# Altium project gps_navigator.PrjPcb
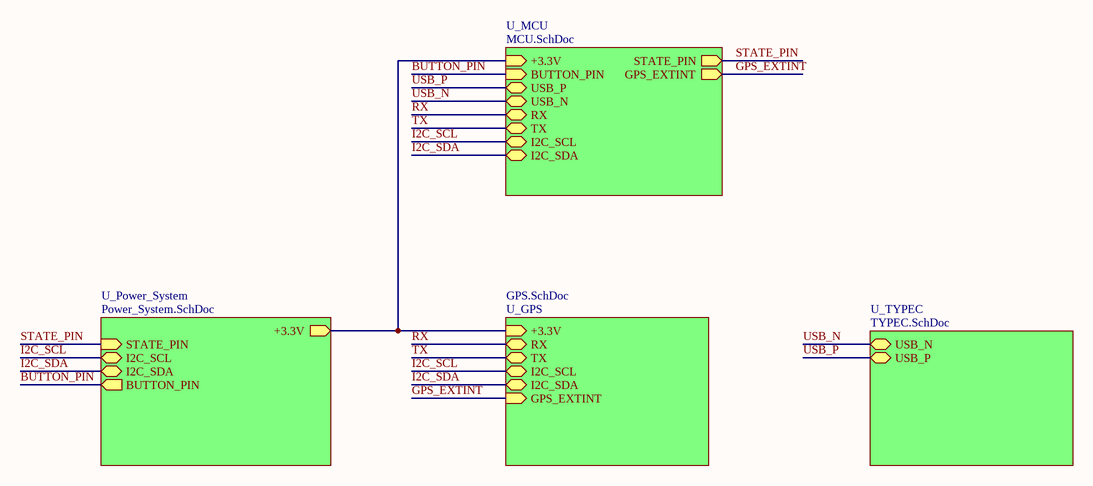
[diagram p0: Top.SchDoc]
ProjectAutor: Olexandr Makedonskyi; ProjectTitle: GPS Navigator; Project Version: v1.0
5 sheets, 74 parts. Net scope: hierarchical (ports join the sheet entries above them; power ports are global).
Board file: gps.PcbDoc
Sheets:
  Top.SchDoc
    U_Power_System = Power_System.SchDoc
    U_MCU = MCU.SchDoc
    U_TYPEC = TYPEC.SchDoc
    U_GPS = GPS.SchDoc

## Sheet Top.SchDoc
size A4; SheetNumber: 1; SheetTotal: 5

### Sub-sheets
U_GPS = GPS.SchDoc: RX (bidir), TX (bidir), I2C_SCL (bidir), I2C_SDA (bidir), +3.3V (in), GPS_EXTINT (in)
U_MCU = MCU.SchDoc: STATE_PIN (out), BUTTON_PIN (in), USB_P (bidir), USB_N (bidir), RX (bidir), TX (bidir), I2C_SCL (bidir), I2C_SDA (bidir), +3.3V (in), GPS_EXTINT (out)
U_Power_System = Power_System.SchDoc: STATE_PIN (in), BUTTON_PIN (out), +3.3V (out), I2C_SCL (bidir), I2C_SDA (bidir)
U_TYPEC = TYPEC.SchDoc: USB_N (bidir), USB_P (bidir)

### Nets
+3.3V: sheet U_Power_System/+3.3V, sheet U_MCU/+3.3V, sheet U_GPS/+3.3V
BUTTON_PIN: sheet U_Power_System/BUTTON_PIN, sheet U_MCU/BUTTON_PIN
GPS_EXTINT: sheet U_MCU/GPS_EXTINT, sheet U_GPS/GPS_EXTINT
I2C_SCL: sheet U_Power_System/I2C_SCL, sheet U_MCU/I2C_SCL, sheet U_GPS/I2C_SCL
I2C_SDA: sheet U_Power_System/I2C_SDA, sheet U_MCU/I2C_SDA, sheet U_GPS/I2C_SDA
RX: sheet U_MCU/RX, sheet U_GPS/RX
STATE_PIN: sheet U_Power_System/STATE_PIN, sheet U_MCU/STATE_PIN
TX: sheet U_MCU/TX, sheet U_GPS/TX
USB_N: sheet U_MCU/USB_N, sheet U_TYPEC/USB_N
USB_P: sheet U_MCU/USB_P, sheet U_TYPEC/USB_P

## Sheet Power_System.SchDoc
size A3; SheetNumber: 3; SheetTotal: 5
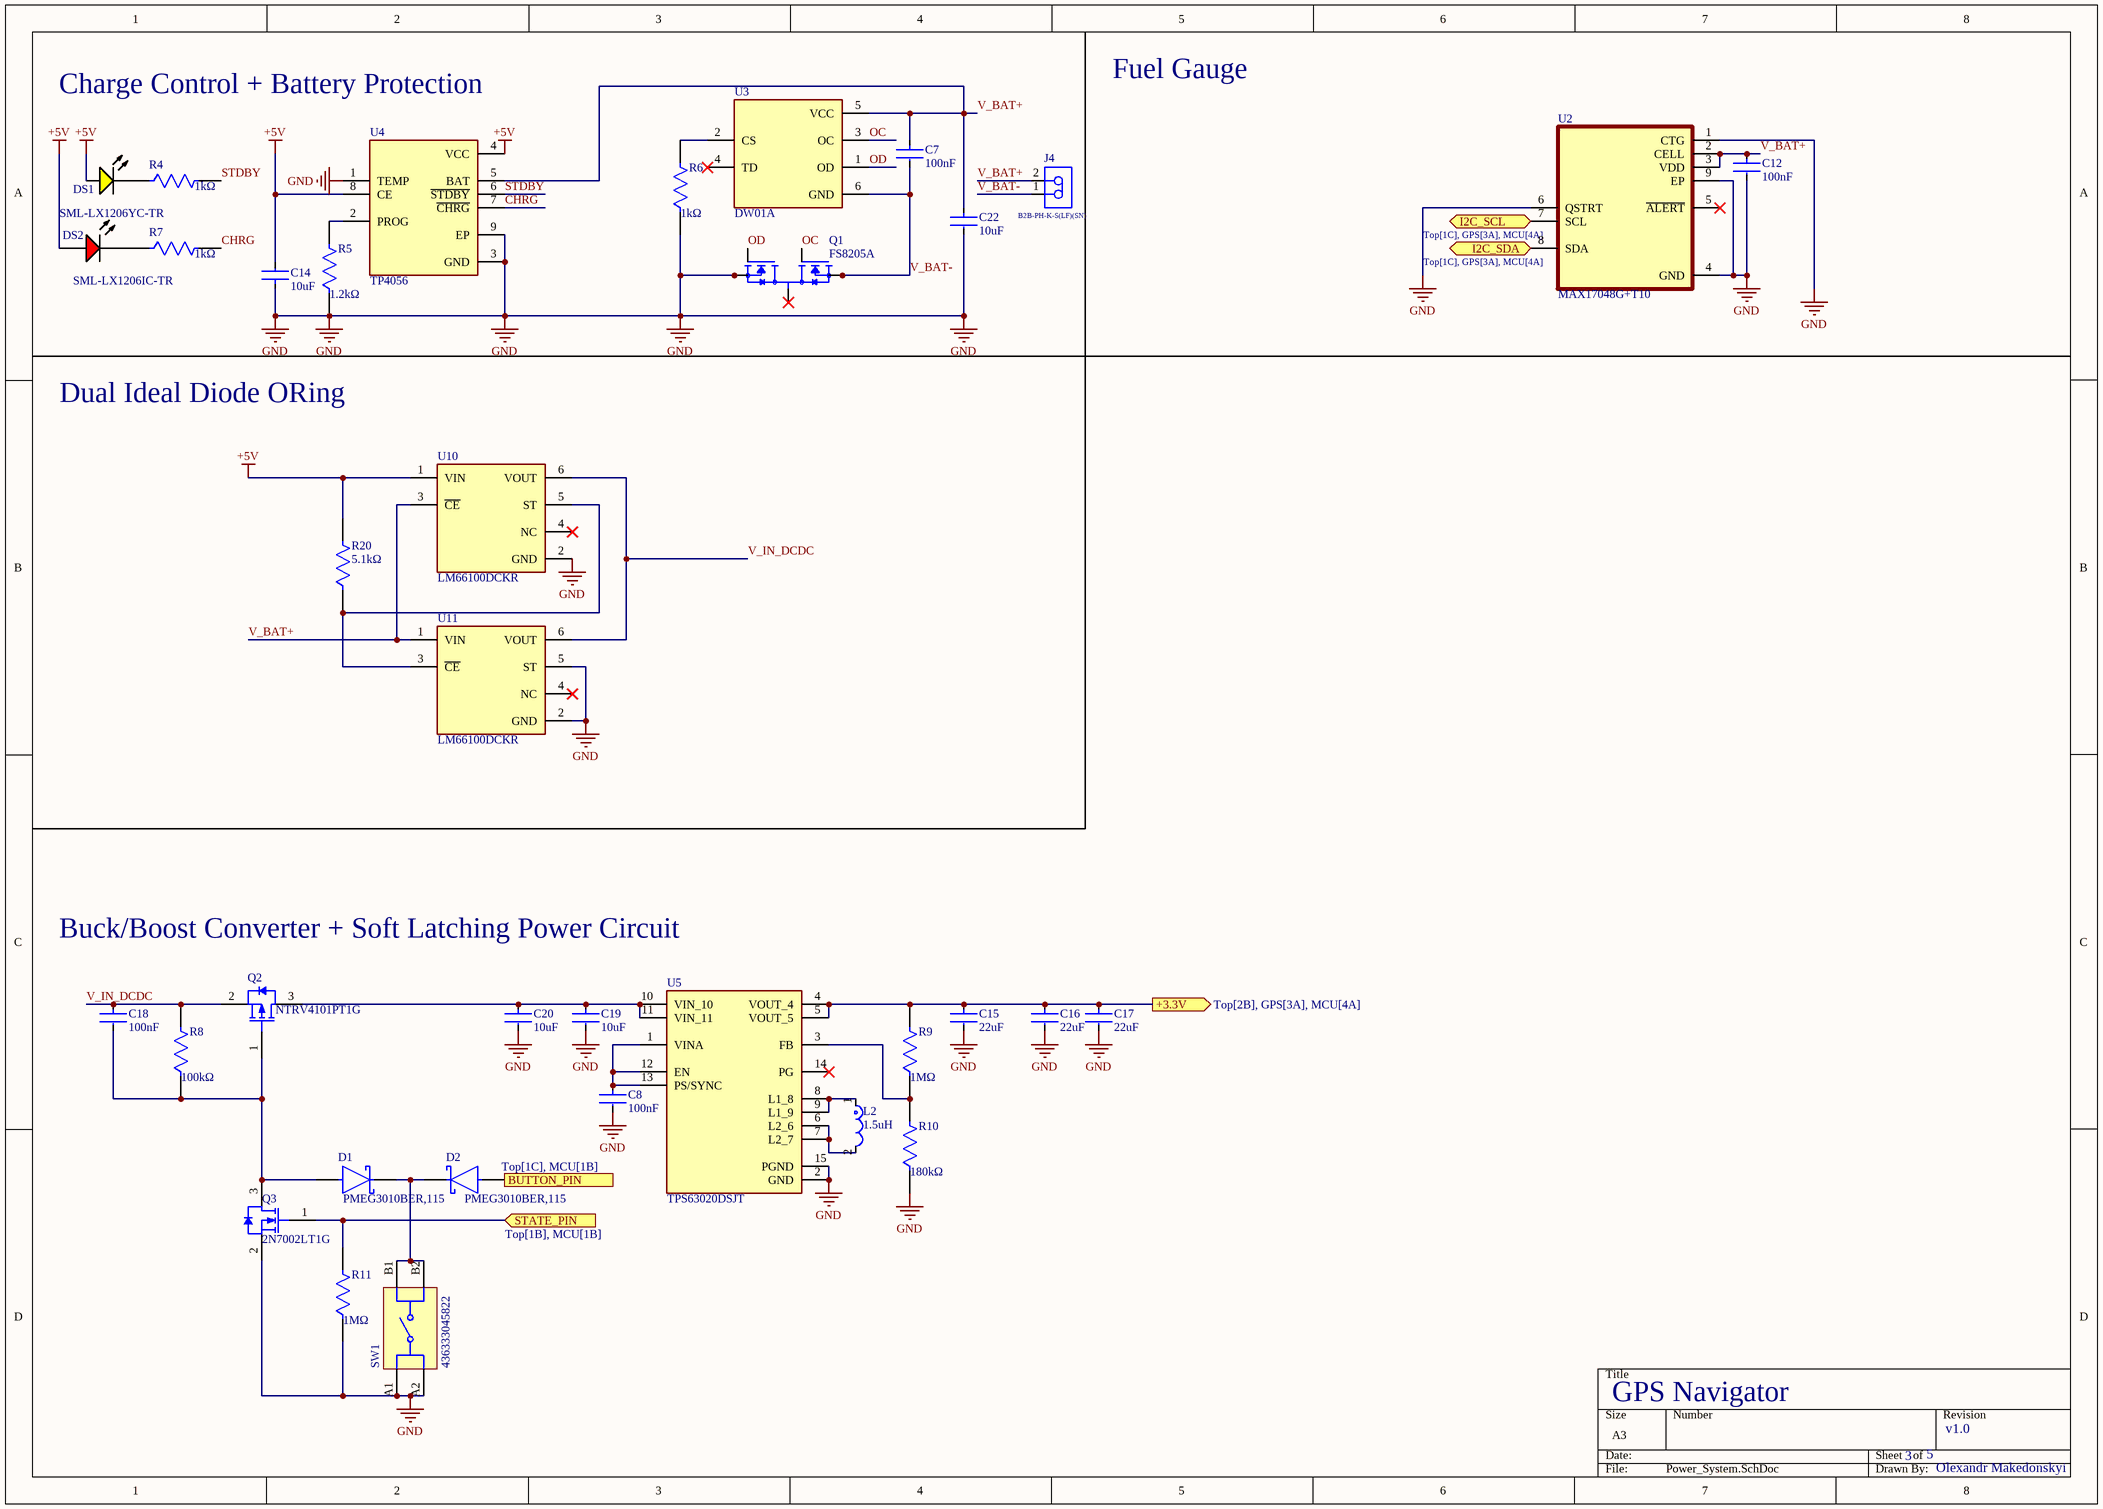
[diagram p1: Power_System.SchDoc]

### Parts
C7  100nF  [0402_CAPACITOR]
C8  100nF  [0402_CAPACITOR]
C12  100nF  [0603_CAPACITOR]
C14  10uF  [0402_CAPACITOR]
C15  22uF  [0603_CAPACITOR]
C16  22uF  [0603_CAPACITOR]
C17  22uF  [0603_CAPACITOR]
C18  100nF  [0603_CAPACITOR]
C19  10uF  [0603_CAPACITOR]
C20  10uF  [0603_CAPACITOR]
C22  10uF  [0402_CAPACITOR]
D1  PMEG3010BER,115  [SHOTTKY]
D2  PMEG3010BER,115  [SHOTTKY]
DS1  SML-LX1206YC-TR  [YELLOW_LED_1206]
DS2  SML-LX1206IC-TR  [RED_LED_1206]
J4  B2B-PH-K-S(LF)(SN)  [JST-B2B-PH-K-S_V]
L2  1.5uH  [1.5uH]
Q1  FS8205A  [SOP65P640X120-8N]
Q2  NTRV4101PT1G  [P_CHANNEL_MOSFET]
Q3  2N7002LT1G  [N_CHANNEL_MOSFET]
R4  value 1kΩ  [0402_RESISTOR]  (hidden comment: RESISTOR)
R5  value 1.2kΩ  [0402_RESISTOR]  (hidden comment: RESISTOR)
R6  value 1kΩ  [0402_RESISTOR]  (hidden comment: RESISTOR)
R7  value 1kΩ  [0402_RESISTOR]  (hidden comment: RESISTOR)
R8  value 100kΩ  [0603_RESISTOR]  (hidden comment: RESISTOR)
R9  value 1MΩ  [0603_RESISTOR]  (hidden comment: RESISTOR)
R10  value 180kΩ  [0603_RESISTOR]  (hidden comment: RESISTOR)
R11  value 1MΩ  [0603_RESISTOR]  (hidden comment: RESISTOR)
R20  value 5.1kΩ  [0603_RESISTOR]
SW1  436333045822  [SIDE_BUTTON]
U2  MAX17048G+T10  [MAX17048]
U3  DW01A  [SOT95P280X145-6N]
U4  TP4056  [SOP127P600X175-9N]
U5  TPS63020DSJT  [IC_TPS63020DSJT]
U10  LM66100DCKR  [ideal_diode]
U11  LM66100DCKR  [ideal_diode]

### Ports
+3.3V (out, see Top[2B], GPS[3A], MCU[4A]), BUTTON_PIN (out, see Top[1C], MCU[1B]), I2C_SCL (bidir, see Top[1C], GPS[3A], MCU[4A]), I2C_SDA (bidir, see Top[1C], GPS[3A], MCU[4A]), STATE_PIN (in, see Top[1B], MCU[1B])

### Nets
+5V: C14.2 DS1.1(A) DS2.1(A) R20.2 U4.4(VCC) U4.8(CE) U10.1(VIN)
GND: C8.2 C12.2 C14.1 C15.2 C16.2 C17.2 C19.2 C20.2 C22.2 Q1.2(S1) Q1.3(S1) Q3.2(S) R5.1 R6.1 R10.1 R11.1 SW1.A1 SW1.A2 U2.1(CTG) U2.4(GND) U2.6(QSTRT) U2.9(EP) U4.1(TEMP) U4.3(GND) U4.9(EP) U5.2(GND) U5.15(PGND) U10.2(GND) U11.2(GND) U11.5(ST)
+3.3V: C15.1 C16.1 C17.1 R9.2 U5.4(VOUT_4) U5.5(VOUT_5) ; port +3.3V
BUTTON_PIN: D2.2(A) ; port BUTTON_PIN
CHRG: R7.2 U4.7(~{CHRG})
I2C_SCL: U2.7(SCL) ; port I2C_SCL
I2C_SDA: U2.8(SDA) ; port I2C_SDA
OC: Q1.5(G2) U3.3(OC)
OD: Q1.4(G1) U3.1(OD)
STATE_PIN: Q3.1(G) R11.2 ; port STATE_PIN
STDBY: R4.2 U4.6(~{STDBY})
V_BAT+: C7.1 C12.1 C22.1 J4.2 U2.2(CELL) U2.3(VDD) U3.5(VCC) U4.5(BAT) U10.3(~{CE}) U11.1(VIN)
V_BAT-: C7.2 J4.1 Q1.6(S2) Q1.7(S2) U3.6(GND)
V_IN_DCDC: C18.1 Q2.2(S) R8.2 U10.6(VOUT) U11.6(VOUT)
NetC8_1: C8.1 U5.1(VINA) U5.12(EN) U5.13(PS/SYNC)
NetC18_2: C18.2 D1.2(A) Q2.1(G) Q3.3(D) R8.1
NetC19_1: C19.1 C20.1 Q2.3(D) U5.10(VIN_10) U5.11(VIN_11)
NetD1_1: D1.1(K) D2.1(K) SW1.B1 SW1.B2
NetDS1_2: DS1.2(K) R4.1
NetDS2_2: DS2.2(K) R7.1
NetL2_1: L2.1 U5.8(L1_8) U5.9(L1_9)
NetL2_2: L2.2 U5.6(L2_6) U5.7(L2_7)
NetQ1_1: Q1.1(D12) Q1.8(D12)
NetR5_2: R5.2 U4.2(PROG)
NetR6_2: R6.2 U3.2(CS)
NetR9_1: R9.1 R10.2 U5.3(FB)
NetR20_1: R20.1 U10.5(ST) U11.3(~{CE})

Not connected (* = marked no-connect by the designer): U2 5(~{ALERT})*; U3 4(TD)*; U5 14(PG)*; U10 4(NC)*; U11 4(NC)*

### Notes on the sheet
- Charge Control + Battery Protection
- Fuel Gauge
- Dual Ideal Diode ORing
- Buck/Boost Converter + Soft Latching Power Circuit

### Library data of the parts
C7 C8 C12 C14-C20 C22 = CMP-001-00091-1: Design Item ID: CAPACITOR; Source: gps_project_schematic_library.SchLib
D1 D2 = SHOTTKY: DIODE SCHOTTKY 30V 1A SOD123W; Manufacturer: Nexperia; Automotive Grade: Grade 0; Max Surge Forward Current: 50A; Peak Reverse Current: 15uA; Max Junction Temp: +150°C; Capacitance: 170pF; Value: 170pF; ComponentLink2URL: https://assets.nexperia.com/documents/data-sheet/PMEG3010BER.pdf; Reverse Voltage: 30V; Forward Current: 1A; Ambient Temperature Range Low: -55°C; Ambient Temperature Range High: +150°C; Octopart: https://octopart.com/pmeg3010ber%2C115-nexperia-78741454; Package: SOD123W; Category: Diode; Lead Free: Yes; Digikey Description: DIODE SCHOTTKY 30V 1A SOD123W; Automotive: Yes; RoHS: TRUE; Height: 1.1mm; Temperature: to +150°C; Device Class L2: Diodes; ComponentLink2Description: Datasheet; Manufacturer Part Number: PMEG3010BER,115; Temperature Range High: +150°C; Device Class L3: Schottky Diodes; Device Class L1: Discrete Semiconductors; Footprint Url: https://assets.nexperia.com/documents/outline-drawing/SOD123W.pdf
DS1 = YELLOW_LED_1206: Yellow LED, Water Clear Len, 585 nm, 2.1 V, -40 to 85 degC, 2-Pin SMD, RoHS, Tape and Reel; Manufacturer: Lumex; Product Training Modules: LEDsBenefitsofCustomLEDandLCDTechnology; Millicandela Rating: 6mcd; Catalog Drawings: SML-LX1206SeriesTopSML-LX1206SeriesSideSML-LX1206SeriesBottomSML-LX1206SeriesFootprint; Wavelength - Peak: 585nm; Other Names: 67-1358-2LU60357TRSMLLX1206YCTR; Lens Style/Size: RectanglewithFlatTop; Current - Test: 20mA; Lens Color: Colorless; Viewing Angle: 160°; Voltage - Forward (Vf) (Typ): 2.1V; Online Catalog: SML-LX1206RectanglewithFlatTop1206PackageLEDs; Mounting Type: SurfaceMount; Package Description: 2-Pin Surface Mount Device, Body 3.2 x 1.5 mm; Datasheet Version: Rev. K, 08/2012; Features: -; Color: Yellow; RoHS Information: RoHSCertofCompliance; Package Reference: SML-LX1206YC-TR; Supplier Device Package: 1206; Standard Package: 3,000; Series: -; Wavelength - Dominant: -; Package / Case: 1206(3216Metric); Mounting Technology: SurfaceMount; Height (Max): 1.10mm; Lens Transparency: Clear; Datasheet URL: http://www.lumex.com/content/files/ProductAttachment/SML-LX1206YC-TR.pdf; Family: LEDIndication-Discrete; Manufacturer URL: http://www.lumexinstruments.com/; Packaging: Tape&Reel(TR); Category: Optoelectronics; Size / Dimension: 3.20mmLx1.60mmW
DS2 = LED_RED_1206: LED Red, 65 mW, -40 to 85 degC, 2-Pin SMD, RoHS, Tape and Reel; Manufacturer: Lumex; LED Material: GaAsP; Peak Wavelength: 635nm; Number of LEDs: 1; Viewing Angle: 160; Reverse Voltage: 5(Min)V; Lens Appearance: ColorlessNonDiffused; Intensity: 6mcd; Type: Uni-Color; Pin_Count: 2; Lens Dimensions: 2x1.6x0.5mm; Mounting: SurfaceMount; ECCN: EAR99; RoHS: Unknown; Package Description: 2-Pin Surface Mount Device, Body 3.2 x 1.5 mm; Mounting Technology: SurfaceMount; Dominant Wavelength: N/A; Supplier_Package: SMD; Supplier Standard Pack: 3,000; Color: Red; Dimension: 3.2x1.6x1.1mm; HTS: 8541402000; Part No: SML-LX1206IC-TR; Family: SML-LX1206IC; Supplier: Lumex; Datasheet URL: http://www.lumex.com/content/files/ProductAttachment/SML-LX1206IC-TR.pdf; Package Reference: SML-LX1206IC; Manufacturer URL: http://www.lumexinstruments.com/; Operating Temperature: -25to85C; Packaging: TapeandReel; Datasheet Version: Rev. J, 08/2012
J4 = JST CONNECTOR: Male Header, Pitch 2 mm, 1 x 2 Position, Height 6 mm, Tail Length 3.4 mm, -25 to 85 degC, RoHS, Bulk; Manufacturer: JST; Pitch: 2mm; Style/Orientation: StraightHeader/Plug; No of Positions: 2; Datasheet Version: Nov-08; Datasheet URL: http://datasheet.octopart.com/B2B-PH-K-S%28LF%29%28SN%29-JST-datasheet-8324864.pdf; Manufacturer URL: http://www.jst.com/home2.html; Type: ShroudedHeader; Termination: Crimp
L2 = 1.5uH: Inductor Power Shielded Wirewound 1.5uH 20% 100KHz 9.1A 15.8mOhm DCR 1515 Automotive Embossed Plastic T/R; Core Material: Composite; DC Resistance (DCR): 15.8mR; Saturation Current: 4.1A; Self Resonant Frequency: 59MHz; Tolerance: 20%; Inductance: 1.5uH; Max DC Current: 9.1A; RoHS Compliant: Yes; Max Operating Temperature: 125°C; Length: 4.3mm; Case/Package: SMD/SMT; Mount: Surface Mount; Shielding: Shielded; Min Operating Temperature: -40°C; RMS Current (Irms): 9.1A; Test Frequency: 100kHz; Inductance Tolerance: 20%; REACH SVHC: No SVHC; Packaging: Tape and Reel; Termination: SMD/SMT; Lead Free: Contains Lead; Width: 4.3mm; Series: XFL4020; Height: 2.1mm
Q1 = FS8205A: MF: Fortune Semiconductor; SnapEDA_Link: https://www.snapeda.com/parts/FS8205A/Fortune+Semiconductor/view-part/?ref=snap; Package: Package; Value: *; MP: FS8205A; Check_prices: https://www.snapeda.com/parts/FS8205A/Fortune+Semiconductor/view-part/?ref=eda
Q2 = PMOS: Trench Power MOSFET, -20 V, Single P-Channel, 3-Pin SOT-23, Pb-Free, Tape and Reel; Manufacturer: On Semiconductor; Crss Typ (pF): 75; V(BR)DSS Min (V): 20; Coss Typ (pF): 100; Ciss Typ (pF): 675; VGS Max (V): 8; Channel Polarity: P Channel; ID Max (A): 3.2; VGS(th) Max (V): 1.2; Qrr Typ (nC): 1008; ComponentLink2URL: http://www.onsemi.cn/pub_link/Collateral/NTR4101P-D.PDF; PartNumber: NTRV4101PT1G; ComponentLink1Description: Manufacturer URL; Packing: Tape and Reel; ComponentLink1URL: http://www.onsemi.com/; PackageReference: SOT-23-3-318-08; ComponentLink3URL: http://www.onsemi.cn/pub_link/Collateral/318-08.PDF; PackageVersion: Rev. AP, 11/2009; Package Type: SOT-23-3; Configuration: Single; ComponentLink3Description: Package Specification; Mounting Technology: Surface Mount; RoHS: Pb-Free; ComponentLink2Description: Datasheet; PackageDescription: 3-Pin Small Outline Transistor, Body 2.92 x 1.3 mm, Pitch 0.95 mm; DatasheetVersion: Rev. 9
Q3 = NMOS: Small Signal MOSFET, 60 V, 115 mA, N-Channel, 3-Pin SOT-23, Pb-Free, Tape and Reel; Manufacturer: On Semiconductor; Channel Polarity: N Channel; V(BR)DSS Min (V): 60; ID Max (A): 0.115; VGS Max (V): 20; Configuration: Single; VGS(th) Max (V): 2.5; ComponentLink1URL: http://www.onsemi.com/; ComponentLink3Description: Package Specification; ComponentLink3URL: http://www.onsemi.cn/pub_link/Collateral/318-08.PDF; PackageReference: SOT-23-3-318-08; RoHS: Pb-Free; ComponentLink2URL: http://www.onsemi.com/pub_link/Collateral/2N7002L-D.PDF; ComponentLink1Description: Manufacturer URL; Package Type: SOT-23-3; Packing: Tape and Reel; PartNumber: 2N7002LT1G; DatasheetVersion: Rev. 7; Mounting Technology: Surface Mount; ComponentLink2Description: Datasheet; PackageDescription: 3-Pin Small Outline Transistor, Body 2.92 x 1.3 mm, Pitch 0.95 mm; PackageVersion: Rev. AP, 11/2009
R20 = RESISTOR
SW1 = SIDE_BUTTON: Tactile Switch, WS-TASU Series, Side Actuated, SMD, Rectangular Button; Voltage Rating: 12V; Operating Force: 220N; Contact Resistance: 100mΩ; Current Rating: 50mA; Packaging: Tape and Reel; Contact Plating: Silver; Width: 4.7mm; Min Operating Temperature: -40°C; Insulation Resistance: 100MΩ; Height: 1.65mm; Contact Current Rating: 50mA; Max Operating Temperature: 85°C; RoHS: Compliant
U2 = MAX17048G+T10: 3ÂµA 1-Cell/2-Cell Fuel Gauge with ModelGauge; MF: Analog Devices; Package: TDFN-8 Maxim; Price: None; Check_prices: https://www.snapeda.com/parts/MAX17048G+T10/Analog+Devices/view-part/?ref=eda; Value: *; SnapEDA_Link: https://www.snapeda.com/parts/MAX17048G+T10/Analog+Devices/view-part/?ref=snap; MP: MAX17048G+T10; Availability: In Stock; Purchase-URL: https://pricing.snapeda.com/search/part/MAX17048G+T10/?ref=eda
U3 = DW01A: One Cell Lithium-ion/Polymer Battery Protection IC; MF: Fortune Semiconductor; SnapEDA_Link: https://www.snapeda.com/parts/DW01A/Fortune+Semiconductor/view-part/?ref=snap; Package: SOT-23-6 Fortune Semiconductor; Value: *; MP: DW01A; Check_prices: https://www.snapeda.com/parts/DW01A/Fortune+Semiconductor/view-part/?ref=eda
U4 = TP4056: Complete single cell Li-Ion battery with a constant current / constant voltage linear charger; MF: NanJing Top Power ASIC Corp.; Check_prices: https://www.snapeda.com/parts/TP4056/NanJing+Top+Power+ASIC+Corp./view-part/?ref=eda; SnapEDA_Link: https://www.snapeda.com/parts/TP4056/NanJing+Top+Power+ASIC+Corp./view-part/?ref=snap; Price: None; Availability: Not in stock; Package: Package; MP: TP4056; Value: *
U5 = TPS63020DSJT: High Efficiency Single Inductor Buck-Boost Converter with 4A Switch; MF: Texas Instruments; SnapEDA_Link: https://www.snapeda.com/parts/TPS63020DSJT/Texas+Instruments/view-part/?ref=snap; Package: VSON-14 Texas Instruments; Value: *; MP: TPS63020DSJT; Check_prices: https://www.snapeda.com/parts/TPS63020DSJT/Texas+Instruments/view-part/?ref=eda
U10 U11 = LM66100DCKR: 1.5-V to 5.5-V, 1.5-A, 0.5-ÂµA IQ ideal diode with integrated FET; MF: Texas Instruments; SnapEDA_Link: https://www.snapeda.com/parts/LM66100DCKR/Texas+Instruments/view-part/?ref=snap; Package: SOT-SC70-6 Texas Instruments; Value: *; MP: LM66100DCKR; Check_prices: https://www.snapeda.com/parts/LM66100DCKR/Texas+Instruments/view-part/?ref=eda

## Sheet MCU.SchDoc
size A4; SheetNumber: 2; SheetTotal: 5
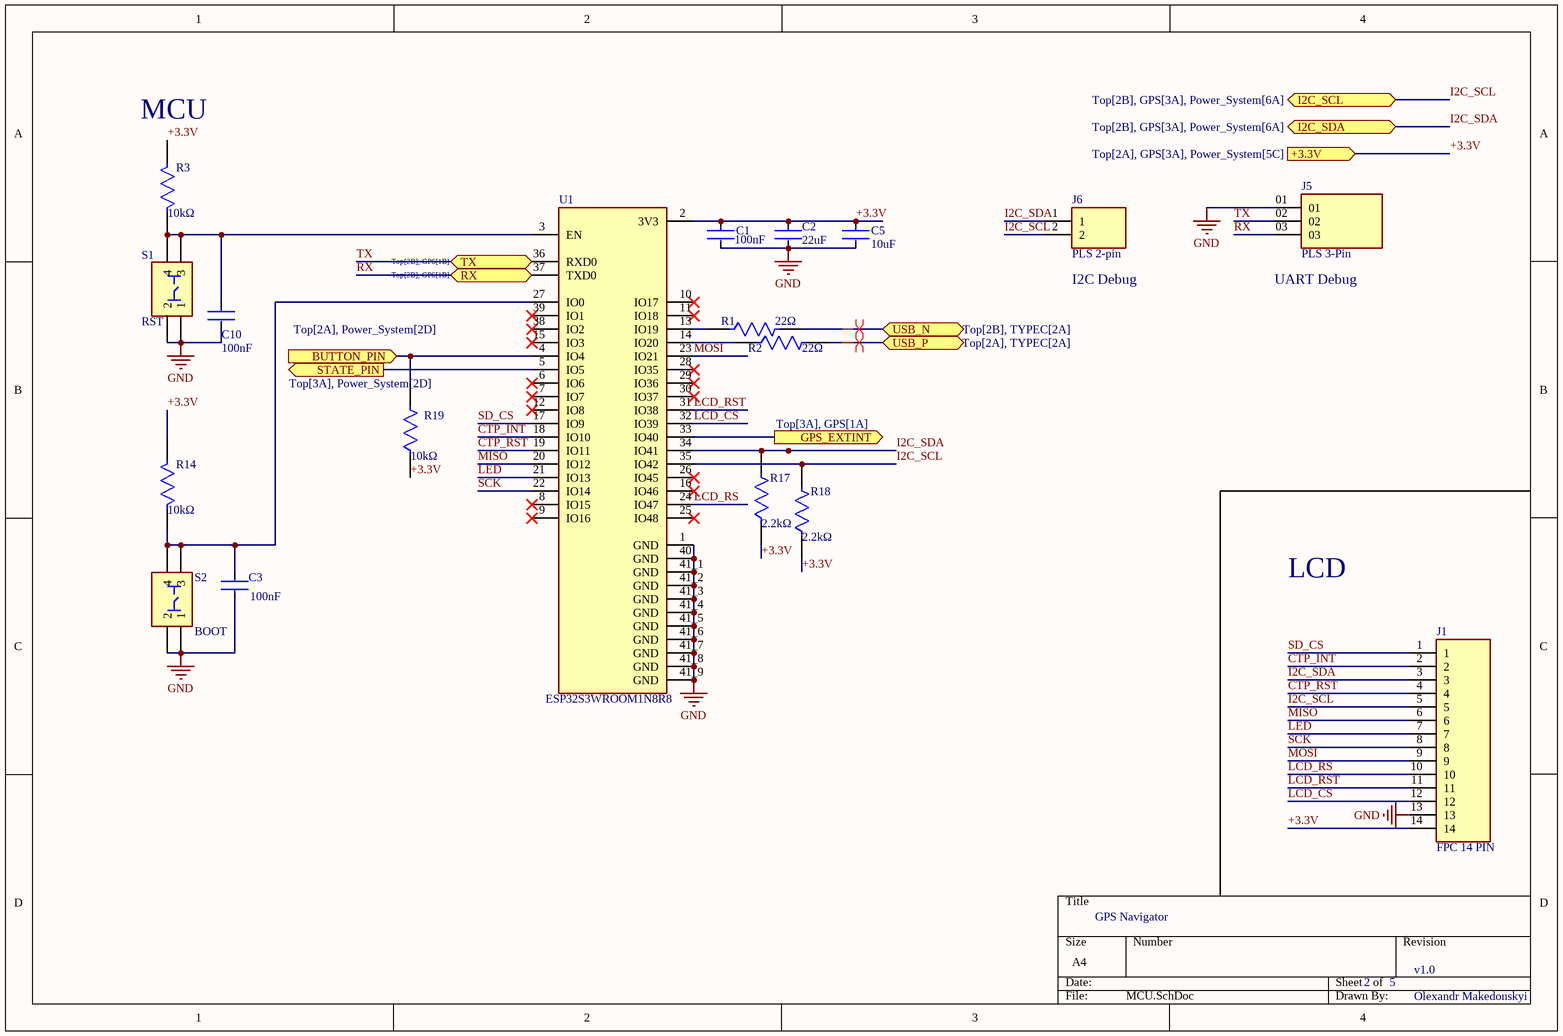
[diagram p2: MCU.SchDoc]

### Parts
C1  100nF  [0603_CAPACITOR]
C2  22uF  [0603_CAPACITOR]
C3  100nF  [0603_CAPACITOR]
C5  10uF  [0603_CAPACITOR]
C10  100nF  [0603_CAPACITOR]
J1  FPC 14 PIN  [AMPHENOL_10051922-1410ELF]
J5  PLS 3-Pin  [SAMTEC_MTLW-103-05-G-S-135]
J6  PLS 2-pin  [2-pin_pls]
R1  value 22Ω  [0402_RESISTOR]  (hidden comment: RESISTOR)
R2  value 22Ω  [0402_RESISTOR]  (hidden comment: RESISTOR)
R3  value 10kΩ  [0603_RESISTOR]  (hidden comment: RESISTOR)
R14  value 10kΩ  [0603_RESISTOR]  (hidden comment: RESISTOR)
R17  value 2.2kΩ  [0603_RESISTOR]  (hidden comment: RESISTOR)
R18  value 2.2kΩ  [0603_RESISTOR]  (hidden comment: RESISTOR)
R19  value 10kΩ  [0402_RESISTOR]  (hidden comment: RESISTOR)
S1  RST  [SMD_BUTTON]
S2  BOOT  [SMD_BUTTON]
U1  ESP32S3WROOM1N8R8  [XCVR_ESP32S3WROOM1N8R8]

### Ports
+3.3V (in, see Top[2A], GPS[3A], Power_System[5C]), BUTTON_PIN (in, see Top[2A], Power_System[2D]), GPS_EXTINT (out, see Top[3A], GPS[1A]), I2C_SCL (bidir, see Top[2B], GPS[3A], Power_System[6A]), I2C_SDA (bidir, see Top[2B], GPS[3A], Power_System[6A]), RX (bidir, see Top[2B], GPS[1B]), STATE_PIN (out, see Top[3A], Power_System[2D]), TX (bidir, see Top[2B], GPS[1B]), USB_N (bidir, see Top[2B], TYPEC[2A]), USB_P (bidir, see Top[2A], TYPEC[2A])

### Nets
GND: C1.2 C2.2 C3.1 C5.2 C10.2 J1.13 J5.01 S1.1 S1.2 S2.1 S2.2 U1.1(GND) U1.40(GND) U1.41_1(GND) U1.41_2(GND) U1.41_3(GND) U1.41_4(GND) U1.41_5(GND) U1.41_6(GND) U1.41_7(GND) U1.41_8(GND) U1.41_9(GND)
+3.3V: C1.1 C2.1 C5.1 J1.14 R3.2 R14.2 R17.1 R18.1 R19.1 U1.2(3V3) ; port +3.3V
BUTTON_PIN: R19.2 U1.4(IO4) ; port BUTTON_PIN
CTP_INT: J1.2 U1.18(IO10)
CTP_RST: J1.4 U1.19(IO11)
GPS_EXTINT: U1.33(IO40) ; port GPS_EXTINT
I2C_SCL: J1.5 J6.2 R18.2 U1.35(IO42) ; port I2C_SCL
I2C_SDA: J1.3 J6.1 R17.2 U1.34(IO41) ; port I2C_SDA
LCD_CS: J1.12 U1.32(IO39)
LCD_RS: J1.10 U1.24(IO47)
LCD_RST: J1.11 U1.31(IO38)
LED: J1.7 U1.21(IO13)
MISO: J1.6 U1.20(IO12)
MOSI: J1.9 U1.23(IO21)
RX: J5.03 U1.37(TXD0) ; port RX
SCK: J1.8 U1.22(IO14)
SD_CS: J1.1 U1.17(IO9)
STATE_PIN: U1.5(IO5) ; port STATE_PIN
TX: J5.02 U1.36(RXD0) ; port TX
USB_N: R1.2 ; port USB_N
USB_P: R2.2 ; port USB_P
NetC3_2: C3.2 R14.1 S2.3 S2.4 U1.27(IO0)
NetC10_1: C10.1 R3.1 S1.3 S1.4 U1.3(EN)
NetR1_1: R1.1 U1.13(IO19)
NetR2_1: R2.1 U1.14(IO20)

Not connected (* = marked no-connect by the designer): U1 6(IO6)* 7(IO7)* 8(IO15)* 9(IO16)* 10(IO17)* 11(IO18)* 12(IO8)* 15(IO3)* 16(IO46)* 25(IO48)* 26(IO45)* 28(IO35)* 29(IO36)* 30(IO37)* 38(IO2)* 39(IO1)*

### Layout directives
differential pair: USB_N, USB_P

### Notes on the sheet
- (near R3) MCU
- (near J6) I2C Debug
- (near J5) UART Debug
- LCD

### Library data of the parts
C1-C3 C5 C10 = CMP-001-00091-1: Design Item ID: CAPACITOR; Source: gps_project_schematic_library.SchLib
J1 = FPC 14 PIN: Conn;Rect; FPC/FFC; 14 Pos; Rt. Ang; 0.5 mm; SMT;ZIF; Low Side Cont; VLL Ser; LF | Amphenol FCI (Amphenol CS) 10051922-1410ELF; SnapEDA_Link: https://www.snapeda.com/parts/10051922-1410ELF/Amphenol/view-part/?ref=snap; Package: None; Value: *; MF: Amphenol; MP: 10051922-1410ELF; Check_prices: https://www.snapeda.com/parts/10051922-1410ELF/Amphenol/view-part/?ref=eda
J5 = MTLW-103-05-G-S-135: CONN HEADER VERT 3POS 2.54MM; MF: Samtec; SnapEDA_Link: https://www.snapeda.com/parts/MTLW-103-05-G-S-135/Samtec/view-part/?ref=snap; Package: None; Value: *; MP: MTLW-103-05-G-S-135; Check_prices: https://www.snapeda.com/parts/MTLW-103-05-G-S-135/Samtec/view-part/?ref=eda
J6 = PLS 2-pin: Conn Unshrouded Header HDR 2 POS 2.54mm Solder ST Thru-Hole; Centerline_Pitch: 2.54 mm[.1 in]; Product_Type: Connector; MF: TE Connectivity; Number_of_Positions: 2; MP: 826646-2; Availability: Good; Price: None; EU_RoHS_Compliance: Compliant; Value: *; DigiKey-Purchase-URL: https://snapeda.com/shop?store=DigiKey&id=470405; Mouser-Purchase-URL: https://snapeda.com/shop?store=Mouser&id=470405; SnapEDA_Link: https://www.snapeda.com/parts/826646-2/TE%20Connectivity%20AMP%20Connectors/view-part/470405/?ref=snap; Package: None
S1 S2 = SMD_BUTTON: Tactile Switch SPST-NO Top Actuated Surface Mount; MF: C&K; MP: PTS810 SJK 250 SMTR LFS; SnapEDA_Link: https://www.snapeda.com/parts/PTS810%20SJK%20250%20SMTR%20LFS/C%2526K/view-part/?ref=snap; Package: None; Value: *; Check_prices: https://www.snapeda.com/parts/PTS810%20SJK%20250%20SMTR%20LFS/C%2526K/view-part/?ref=eda
U1 = ESP32S3WROOM1N8R8: Bluetooth, WiFi 802.11b/g/n, Bluetooth v5.0 Transceiver Module 2.4GHz PCB Trace Surface Mount; MF: Espressif Systems; Price: None; MP: ESP32S3WROOM1N8R8; SnapEDA_Link: https://www.snapeda.com/parts/ESP32S3WROOM1N8R8/Espressif+Systems/view-part/?ref=snap; Package: SMD-41 Espressif Systems; Availability: In Stock; Purchase-URL: https://pricing.snapeda.com/search/part/ESP32S3WROOM1N8R8/?ref=eda; Check_prices: https://www.snapeda.com/parts/ESP32S3WROOM1N8R8/Espressif+Systems/view-part/?ref=eda; Value: *

## Sheet TYPEC.SchDoc
size A4; SheetNumber: 5; SheetTotal: 5
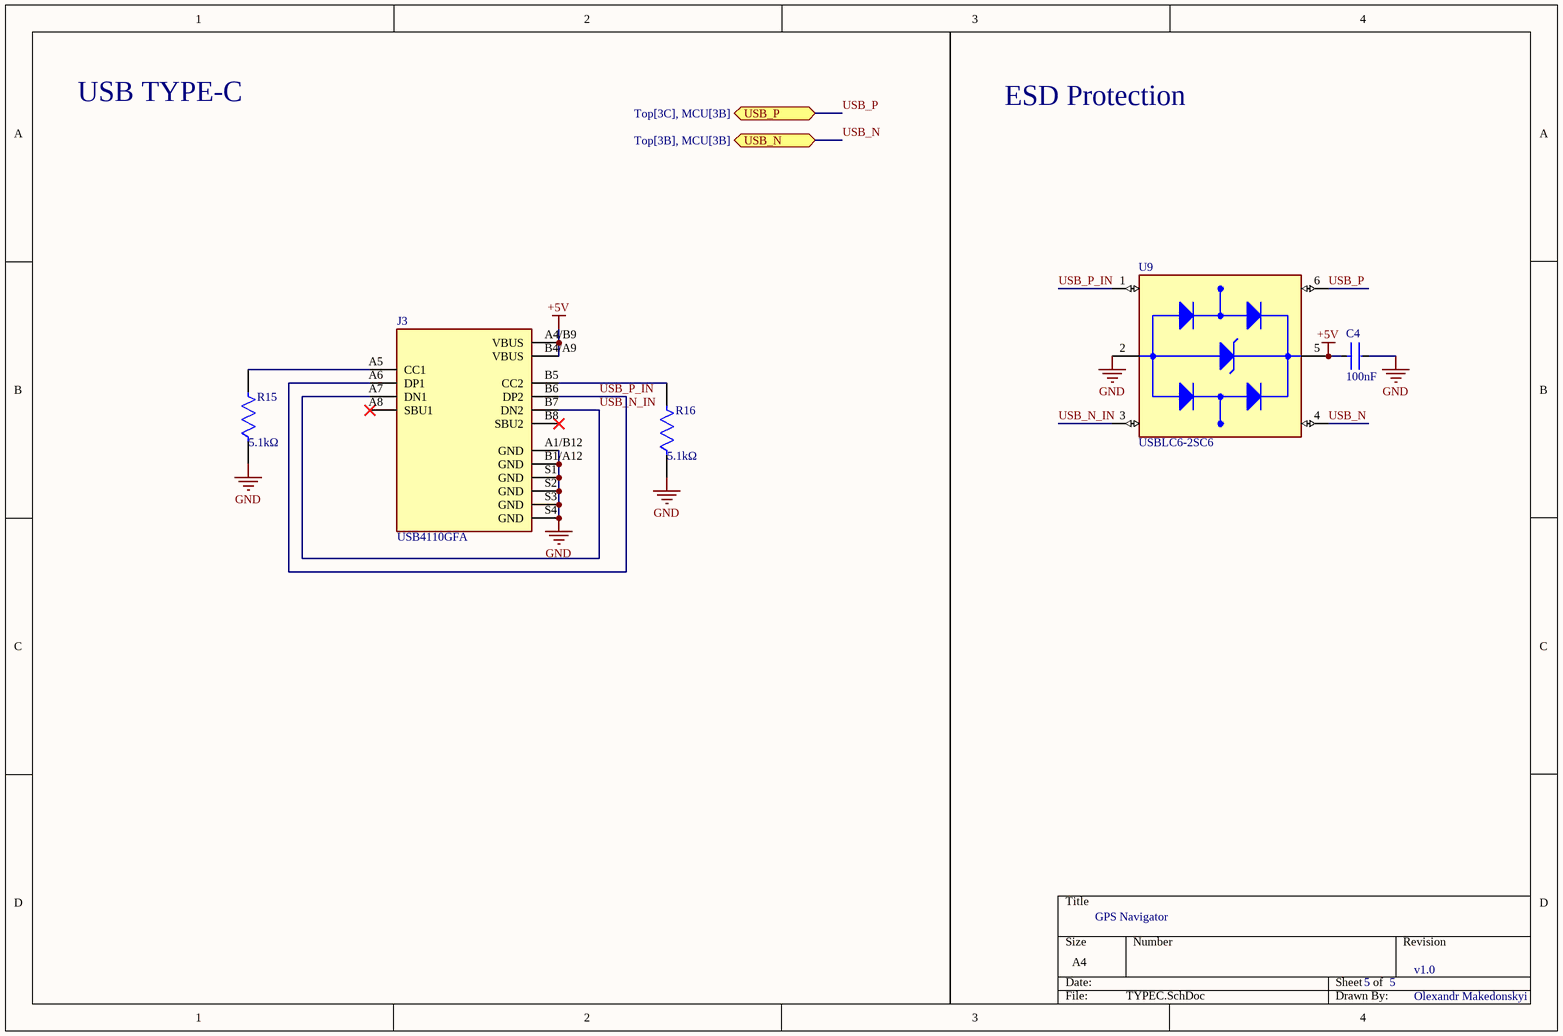
[diagram p3: TYPEC.SchDoc]

### Parts
C4  100nF  [0402_CAPACITOR]
J3  USB4110GFA  [GCT_USB4110GFA]
R15  value 5.1kΩ  [0402_RESISTOR]  (hidden comment: RESISTOR)
R16  value 5.1kΩ  [0603_RESISTOR]  (hidden comment: RESISTOR)
U9  USBLC6-2SC6  [SOT95P280X145-6N]

### Ports
USB_N (bidir, see Top[3B], MCU[3B]), USB_P (bidir, see Top[3C], MCU[3B])

### Nets
+5V: C4.1 J3.A4/B9(VBUS) J3.B4/A9(VBUS) U9.5(VBUS)
GND: C4.2 J3.A1/B12(GND) J3.B1/A12(GND) J3.S1(GND) J3.S2(GND) J3.S3(GND) J3.S4(GND) R15.1 R16.1 U9.2(GND)
USB_N: U9.4(I/O2_OUT) ; port USB_N
USB_N_IN: J3.A7(DN1) J3.B7(DN2) U9.3(I/O2_IN)
USB_P: U9.6(I/O1_OUT) ; port USB_P
USB_P_IN: J3.A6(DP1) J3.B6(DP2) U9.1(I/O1_IN)
NetJ3_A5: J3.A5(CC1) R15.2
NetJ3_B5: J3.B5(CC2) R16.2

Not connected (* = marked no-connect by the designer): J3 A8(SBU1)* B8(SBU2)*

### Notes on the sheet
- USB TYPE-C
- ESD Protection

### Library data of the parts
C4 = CMP-001-00091-1: Design Item ID: CAPACITOR; Source: gps_project_schematic_library.SchLib
J3 = USB4110GFA: USB-C (USB TYPE-C) USB 2.0 Receptacle Connector 24 (16+8 Dummy) Position Surface Mount, Right Angle; MF: Global Connector Technology; SnapEDA_Link: https://www.snapeda.com/parts/USB4110GFA/Global+Connector+Technology/view-part/?ref=snap; Package: None; Value: *; MP: USB4110GFA; Check_prices: https://www.snapeda.com/parts/USB4110GFA/Global+Connector+Technology/view-part/?ref=eda
U9 = USBLC6-2SC6: 17V Clamp 5A (8/20Âµs) Ipp Tvs Diode Surface Mount SOT-23-6; MF: STMicroelectronics; Value: *; SnapEDA_Link: https://www.snapeda.com/parts/USBLC6-2SC6/STMicroelectronics/view-part/?ref=snap; Check_prices: https://www.snapeda.com/parts/USBLC6-2SC6/STMicroelectronics/view-part/?ref=eda; Purchase-URL: https://pricing.snapeda.com/search/part/USBLC6-2SC6/?ref=eda; Price: None; Availability: In Stock; Package: SOT-23-6 STMicroelectronics; MP: USBLC6-2SC6

## Sheet GPS.SchDoc
size A4; SheetNumber: 4; SheetTotal: 5
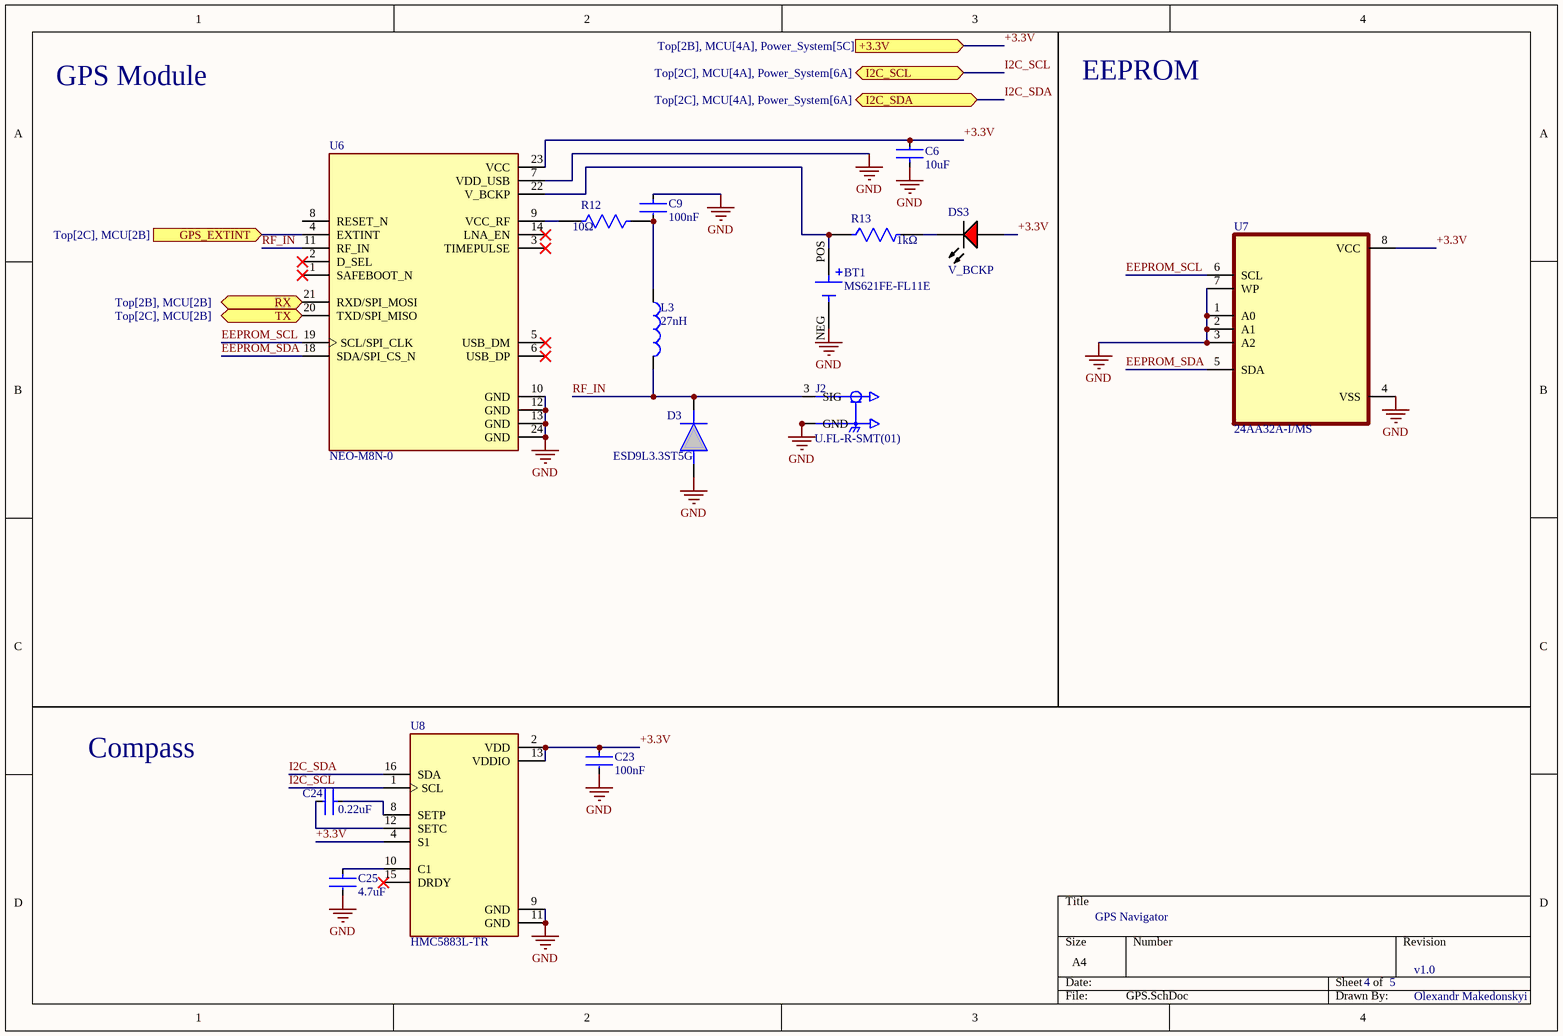
[diagram p4: GPS.SchDoc]

### Parts
BT1  MS621FE-FL11E  [BAT_MS621FE-FL11E]
C6  10uF  [0603_CAPACITOR]
C9  100nF  [0603_CAPACITOR]
C23  100nF  [0402_CAPACITOR]
C24  0.22uF  [0402_CAPACITOR]
C25  4.7uF  [0402_CAPACITOR]
D3  ESD9L3.3ST5G  [DIOM1006X40N]
DS3  V_BCKP  [RED_LED_1206]
J2  U.FL-R-SMT(01)  [HRS_U.FL-R-SMT(01)]
L3  27nH  [27nH]
R12  value 10Ω  [1206_RESISTOR]
R13  value 1kΩ  [0603_RESISTOR]  (hidden comment: RESISTOR)
U6  NEO-M8N-0  [XCVR_NEO-M8N-0]
U7  24AA32A-I/MS  [SOP65P490X110-8N (memory)]
U8  HMC5883L-TR  [XDCR_HMC5883L-TR]

### Ports
+3.3V (in, see Top[2B], MCU[4A], Power_System[5C]), GPS_EXTINT (in, see Top[2C], MCU[2B]), I2C_SCL (bidir, see Top[2C], MCU[4A], Power_System[6A]), I2C_SDA (bidir, see Top[2C], MCU[4A], Power_System[6A]), RX (bidir, see Top[2B], MCU[2B]), TX (bidir, see Top[2C], MCU[2B])

### Nets
GND: BT1.NEG C6.1 C9.1 C23.2 C25.2 D3.2(A) J2.1(GND) J2.2(GND) U6.7(VDD_USB) U6.10(GND) U6.12(GND) U6.13(GND) U6.24(GND) U7.1(A0) U7.2(A1) U7.3(A2) U7.4(VSS) U7.7(WP) U8.9(GND) U8.11(GND)
+3.3V: C6.2 C23.1 DS3.1(A) U6.23(VCC) U7.8(VCC) U8.2(VDD) U8.4(S1) U8.13(VDDIO) ; port +3.3V
EEPROM_SCL: U6.19(SCL/SPI_CLK) U7.6(SCL)
EEPROM_SDA: U6.18(SDA/SPI_CS_N) U7.5(SDA)
GPS_EXTINT: U6.4(EXTINT) ; port GPS_EXTINT
I2C_SCL: U8.1(SCL) ; port I2C_SCL
I2C_SDA: U8.16(SDA) ; port I2C_SDA
RF_IN: D3.1(K) J2.3(SIG) L3.2 U6.11(RF_IN)
RX: U6.21(RXD/SPI_MOSI) ; port RX
TX: U6.20(TXD/SPI_MISO) ; port TX
NetBT1_POS: BT1.POS R13.1 U6.22(V_BCKP)
NetC9_2: C9.2 L3.1 R12.1
NetC24_1: C24.1 U8.8(SETP)
NetC24_2: C24.2 U8.12(SETC)
NetC25_1: C25.1 U8.10(C1)
NetDS3_2: DS3.2(K) R13.2
NetR12_2: R12.2 U6.9(VCC_RF)

Not connected (* = marked no-connect by the designer): U6 1(SAFEBOOT_N)* 2(D_SEL)* 3(TIMEPULSE)* 5(USB_DM)* 6(USB_DP)* 8(RESET_N) 14(LNA_EN)*; U8 15(DRDY)*

### Notes on the sheet
- GPS Module
- EEPROM
- Compass

### Library data of the parts
BT1 = MS621FE-FL11E: Coin, 6.8mm 3 V Lithium Battery Rechargeable (Secondary) 5.5mAh; MF: Seiko Instruments; Value: *; Purchase-URL: https://pricing.snapeda.com/search/part/MS621FE-FL11E/?ref=eda; Package: QFP-128 Seiko; Availability: In Stock; Check_prices: https://www.snapeda.com/parts/MS621FE-FL11E/Seiko+Instruments/view-part/?ref=eda; Price: None; SnapEDA_Link: https://www.snapeda.com/parts/MS621FE-FL11E/Seiko+Instruments/view-part/?ref=snap; MP: MS621FE-FL11E
C6 C9 C23-C25 = CMP-001-00091-1: Design Item ID: CAPACITOR; Source: gps_project_schematic_library.SchLib
D3 = ESD9L3.3ST5G: Transient Voltage Suppressors ESD Protection Diodes with UltraLow Capacitance; Manufacturer_Name: onsemi; Geometry.Height: 0.4mm; Manufacturer_Part_Number: ESD9L3.3ST5G; Mouser Part Number: 863-ESD9L3.3ST5G; Mouser Price/Stock: https://www.mouser.co.uk/ProductDetail/ON-Semiconductor/ESD9L33ST5G?qs=N5dOQkml4H9EihHTKPOUhA%3D%3D; Arrow Part Number: ESD9L3.3ST5G; Arrow Price/Stock: https://www.arrow.com/en/products/esd9l3.3st5g/on-semiconductor?region=nac; Datasheet Link: https://www.onsemi.com/pub/Collateral/ESD9L-D.PDF
DS3 = LED_RED_1206: LED Red, 65 mW, -40 to 85 degC, 2-Pin SMD, RoHS, Tape and Reel; Manufacturer: Lumex; Part No: SML-LX1206IC-TR; LED Material: GaAsP; Peak Wavelength: 635nm; Number of LEDs: 1; Viewing Angle: 160; Reverse Voltage: 5(Min)V; Lens Appearance: ColorlessNonDiffused; Intensity: 6mcd; Type: Uni-Color; Pin_Count: 2; Lens Dimensions: 2x1.6x0.5mm; Mounting: SurfaceMount; ECCN: EAR99; RoHS: Unknown; Package Description: 2-Pin Surface Mount Device, Body 3.2 x 1.5 mm; Mounting Technology: SurfaceMount; Dominant Wavelength: N/A; Supplier_Package: SMD; Supplier Standard Pack: 3,000; Color: Red; Dimension: 3.2x1.6x1.1mm; HTS: 8541402000; Family: SML-LX1206IC; Supplier: Lumex; Datasheet URL: http://www.lumex.com/content/files/ProductAttachment/SML-LX1206IC-TR.pdf; Package Reference: SML-LX1206IC; Manufacturer URL: http://www.lumexinstruments.com/; Operating Temperature: -25to85C; Packaging: TapeandReel; Datasheet Version: Rev. J, 08/2012
J2 = U.FL-R-SMT(01): U.FL (UMCC) Connector Receptacle, Male Pin 50Ohm Surface Mount Solder. RF Connectors / Coaxial Connectors; MF: Hirose; Check_prices: https://www.snapeda.com/parts/U.FL-R-SMT(01)/Hirose+Electric+Co+Ltd/view-part/?ref=eda; Value: *; Availability: In Stock; MP: U.FL-R-SMT(01); Price: None; Package: None; SnapEDA_Link: https://www.snapeda.com/parts/U.FL-R-SMT(01)/Hirose+Electric+Co+Ltd/view-part/?ref=snap; Purchase-URL: https://pricing.snapeda.com/search/part/U.FL-R-SMT(01)/?ref=eda
L3 = 27nH: Inductor with Inductance: 27nH Tol. +/-5%, Package: 0402 _1005_; MP: LQG15HS27NJ02D; MF: Murata; Price: None; Value: *; Package: 1005 Murata; SnapEDA_Link: https://www.snapeda.com/parts/LQG15HS27NJ02D/Murata%20Electronics%20North%20America/view-part/53478/?ref=snap; Availability: Unavailable
R12 = RESISTOR
U6 = NEO-M8N-0: series RF Receiver BeiDou, Galileo, GLONASS, GNSS, GPS 1.575GHz -167dBm - - -; MF: U-Blox America; SnapEDA_Link: https://www.snapeda.com/parts/NEO-M8N-0/u-blox/view-part/?ref=snap; Package: SMD-24 U-Blox America Inc.; Value: *; MP: NEO-M8N-0; Check_prices: https://www.snapeda.com/parts/NEO-M8N-0/u-blox/view-part/?ref=eda
U7 = 24AA32A-I/MS: 32K, 4K X 8 1.8V SERIAL EE IND | Microchip Technology Inc. 24AA32A-I/MS; SnapEDA_Link: https://www.snapeda.com/parts/24AA32A-I/MS/Microchip/view-part/?ref=snap; Package: MSOP-8 Microchip; Value: *; MF: Microchip; MP: 24AA32A-I/MS; Check_prices: https://www.snapeda.com/parts/24AA32A-I/MS/Microchip/view-part/?ref=eda
U8 = HMC5883L-TR: Board Mount Hall Effect / Magnetic Sensors Sensors, Transducers Magnetic - Hall Effect, Digital Switch, Linear, Compass (ICs) - IC COMPASS 3 AXIS I2C 16LCC SMD; MF: STMicroelectronics; MP: HMC5883LTR; SnapEDA_Link: https://www.snapeda.com/parts/HMC5883LTR/STMicroelectronics/view-part/?ref=snap; Package: LCC-16 STMicroelectronics; Value: *; Check_prices: https://www.snapeda.com/parts/HMC5883LTR/STMicroelectronics/view-part/?ref=eda

## Nets that join several sheets
+5V: Power_System (7 pins), TYPEC (C4.1 J3.A4/B9 J3.B4/A9 U9.5)
GND: Power_System (30 pins), MCU (22 pins), TYPEC (10 pins), GPS (20 pins)
+3.3V: Power_System (6 pins), MCU (10 pins), GPS (8 pins)
BUTTON_PIN: Power_System (D2.2), MCU (R19.2 U1.4)
GPS_EXTINT: MCU (U1.33), GPS (U6.4)
I2C_SCL: Power_System (U2.7), MCU (J1.5 J6.2 R18.2 U1.35), GPS (U8.1)
I2C_SDA: Power_System (U2.8), MCU (J1.3 J6.1 R17.2 U1.34), GPS (U8.16)
RX: MCU (J5.03 U1.37), GPS (U6.21)
STATE_PIN: Power_System (Q3.1 R11.2), MCU (U1.5)
TX: MCU (J5.02 U1.36), GPS (U6.20)
USB_N: MCU (R1.2), TYPEC (U9.4)
USB_P: MCU (R2.2), TYPEC (U9.6)